# Altium schematic sheet Rotary Encoder.SchDoc
size OrCAD A; SheetNumber: 17; SheetTotal: 22
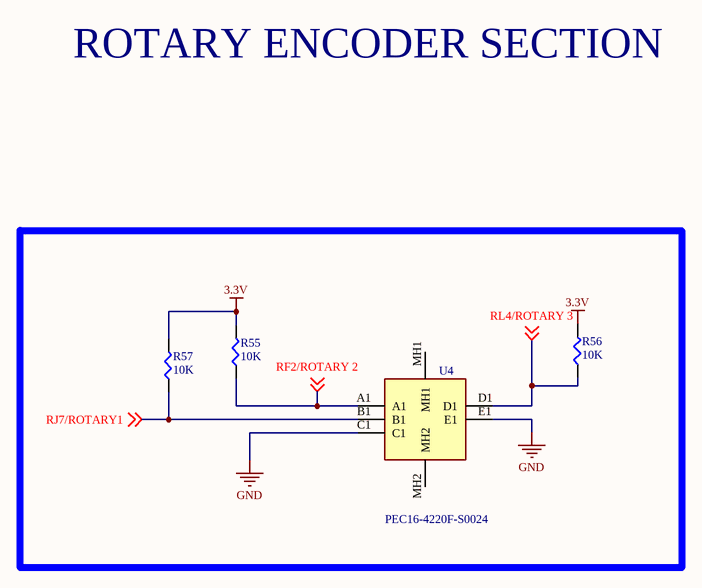
[diagram p0: Rotary Encoder.SchDoc]

## Parts
R55  10K  [SMD-0805-RES]
R56  10K  [SMD-0805-RES]
R57  10K  [SMD-0805-RES]
U4  PEC16-4220F-S0024  [PEC164120FS0012]

## Nets
3.3V: R55.2 R56.2 R57.2
GND: U4.C1 U4.E1
RF2/ROTARY 2: R55.1 U4.A1 ; off-sheet RF2/ROTARY 2
RJ7/ROTARY1: R57.1 U4.B1 ; off-sheet RJ7/ROTARY1
RL4/ROTARY 3: R56.1 U4.D1 ; off-sheet RL4/ROTARY 3

Not connected (* = marked no-connect by the designer): U4 MH1 MH2

## Notes on the sheet
- ROTARY ENCODER SECTION

## Library data of the parts
R55-R57 = ERJ-6ENF1001V: RES SMD 1K OHM 1% 1/8W 0805; Manufacturer: Panasonic Electronic Components; Factory Stock: 0; Unit Price (USD): 0.00729; @ qty: 1500; Minimum Quantity: 1; Power (Watts): 0.125W, 1/8W; Temperature Coefficient: ±100ppm/°C; Part Number: ERJ-6ENF1001V; Datasheets: http://industrial.panasonic.com/www-cgi/jvcr13pz.cgi?E+PZ+3+AOA0002+ERJ6ENF1001V+7+WW; Image: //media.digikey.com/Renders/Panasonic%20Renders/ERJ-0805%20Pkg.jpg; Digi-Key Part Number: P1.00KCCT-ND; Quantity Available: 12895103; Packaging: Cut Tape (CT); Series: ERJ; Part Status: Active; Value: 1k; Tolerance: ±1%; Composition: Thick Film; Features: Automotive AEC-Q200; Operating Temperature: -55°C ~ 155°C; Package / Case: 0805 (2012 Metric); Supplier Device Package: 0805; Size / Dimension: 0.079" L x 0.049" W (2.00mm x 1.25mm); Height - Seated (Max): 0.028" (0.70mm); Number of Terminations: 2; Failure Rate: -
U4 = PEC16-4220F-S0024: Undefined or Miscellaneous; Manufacturer_Name: Bourns; Datasheet Link: https://www.bourns.com/pdfs/PEC16.pdf; Height: 28mm; Manufacturer_Part_Number: PEC16-4220F-S0024; Mouser Part Number: 652-PEC16-4220FS0024; Mouser Price/Stock: https://www.mouser.co.uk/ProductDetail/Bourns/PEC16-4220F-S0024?qs=6FD5PBp7ZtQte%252Bg7b%2FiMUw%3D%3D; Arrow Part Number: PEC16-4220F-S0024; Arrow Price/Stock: https://www.arrow.com/en/products/pec16-4220f-s0024/bourns